# EasyEDA schematic Schematic.json
TITLE: New Schematic; REV: 1.0; Date: 2018-01-26; Sheet: 1/1; Drawn By: ridvanaltun
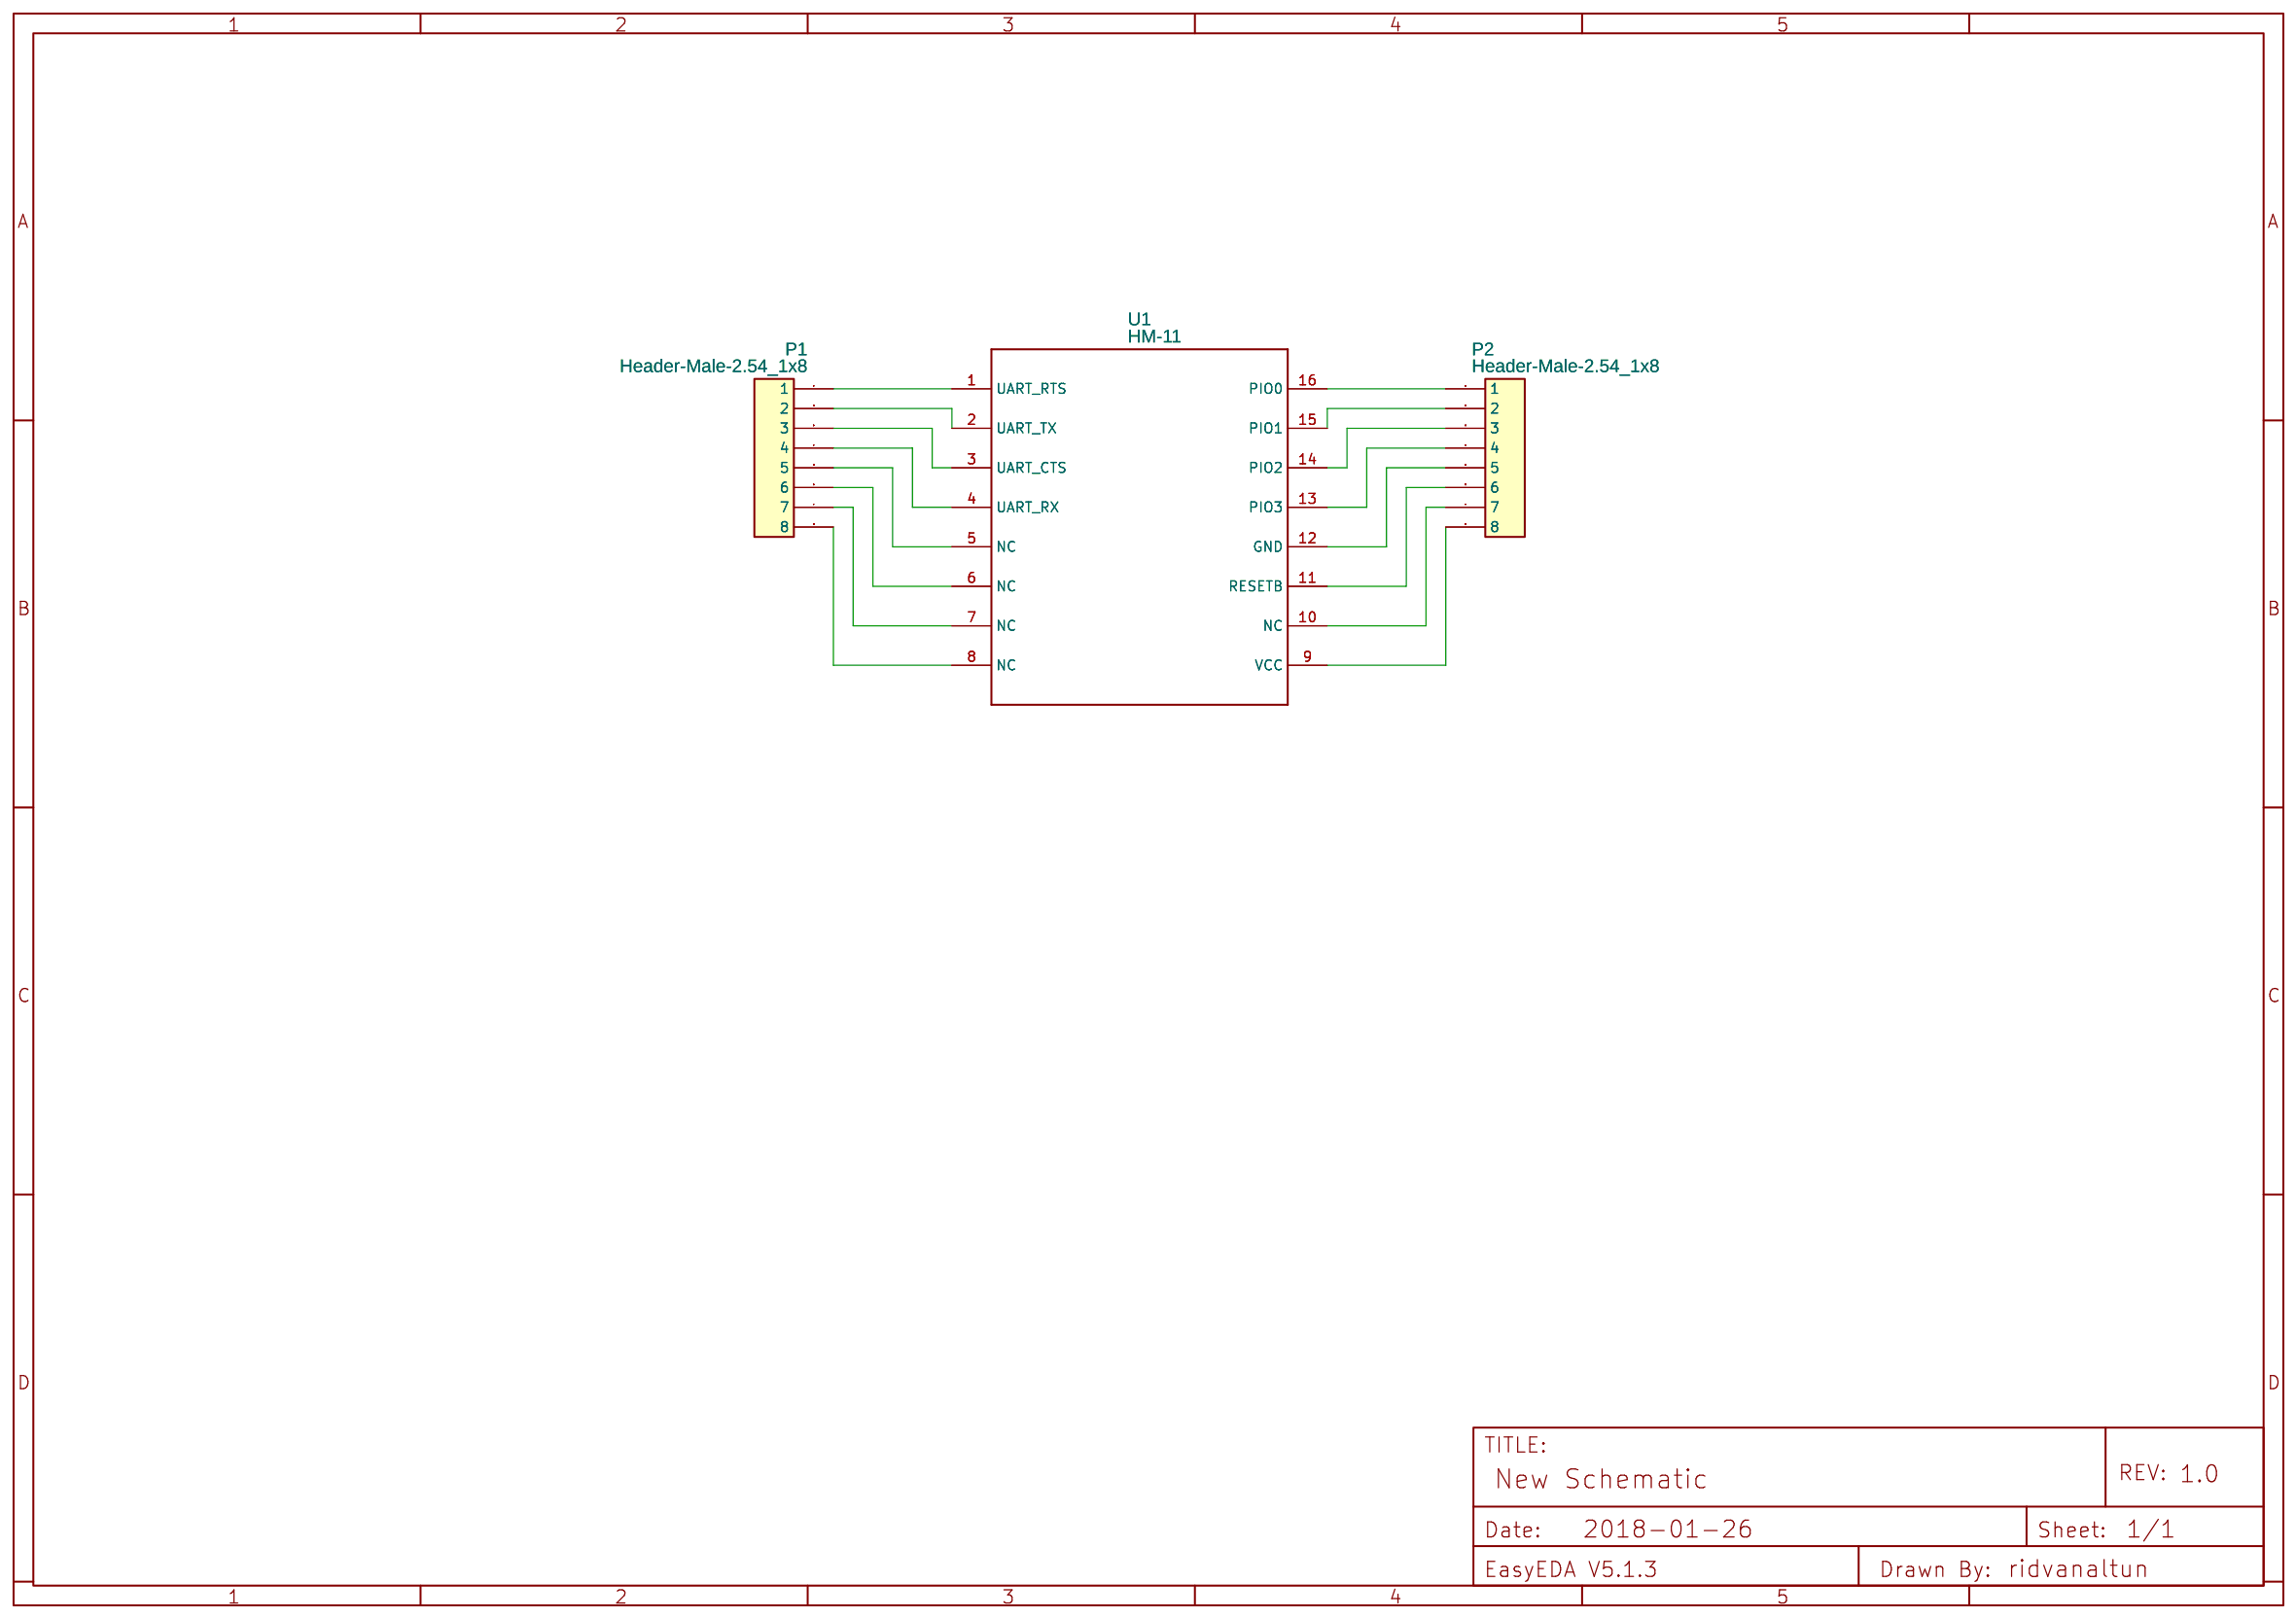
[diagram p0: schematic sheet]

## Parts
P1  Header-Male-2.54_1x8  [HDR-8X1/2.54]
P2  Header-Male-2.54_1x8  [HDR-8X1/2.54]
U1  HM-11  [HM-11]

## Library data of the parts
P1 P2 = -: Supplier: LCSC; Manufacturer: LCSC; LCSC: C49256
U1 = -: JNHuaMao HM-11 Bluetooth 4.0 Transceiver; Contributor: ridvanaltun; Manufacturer Part: ?

## Nets
Net-(P1-1): P1.1 U1.1(UART_RTS)
Net-(P1-2): P1.2 U1.2(UART_TX)
Net-(P1-3): P1.3 U1.3(UART_CTS)
Net-(P1-4): P1.4 U1.4(UART_RX)
Net-(P1-5): P1.5 U1.5(NC)
Net-(P1-6): P1.6 U1.6(NC)
Net-(P1-7): P1.7 U1.7(NC)
Net-(P1-8): P1.8 U1.8(NC)
Net-(P2-1): P2.1 U1.16(PIO0)
Net-(P2-2): P2.2 U1.15(PIO1)
Net-(P2-3): P2.3 U1.14(PIO2)
Net-(P2-4): P2.4 U1.13(PIO3)
Net-(P2-5): P2.5 U1.12(GND)
Net-(P2-6): P2.6 U1.11(RESETB)
Net-(P2-7): P2.7 U1.10(NC)
Net-(P2-8): P2.8 U1.9(VCC)
